# Altium schematic sheet Power and CAN Bus.SchDoc
size B; SheetNumber: 3; SheetTotal: 4
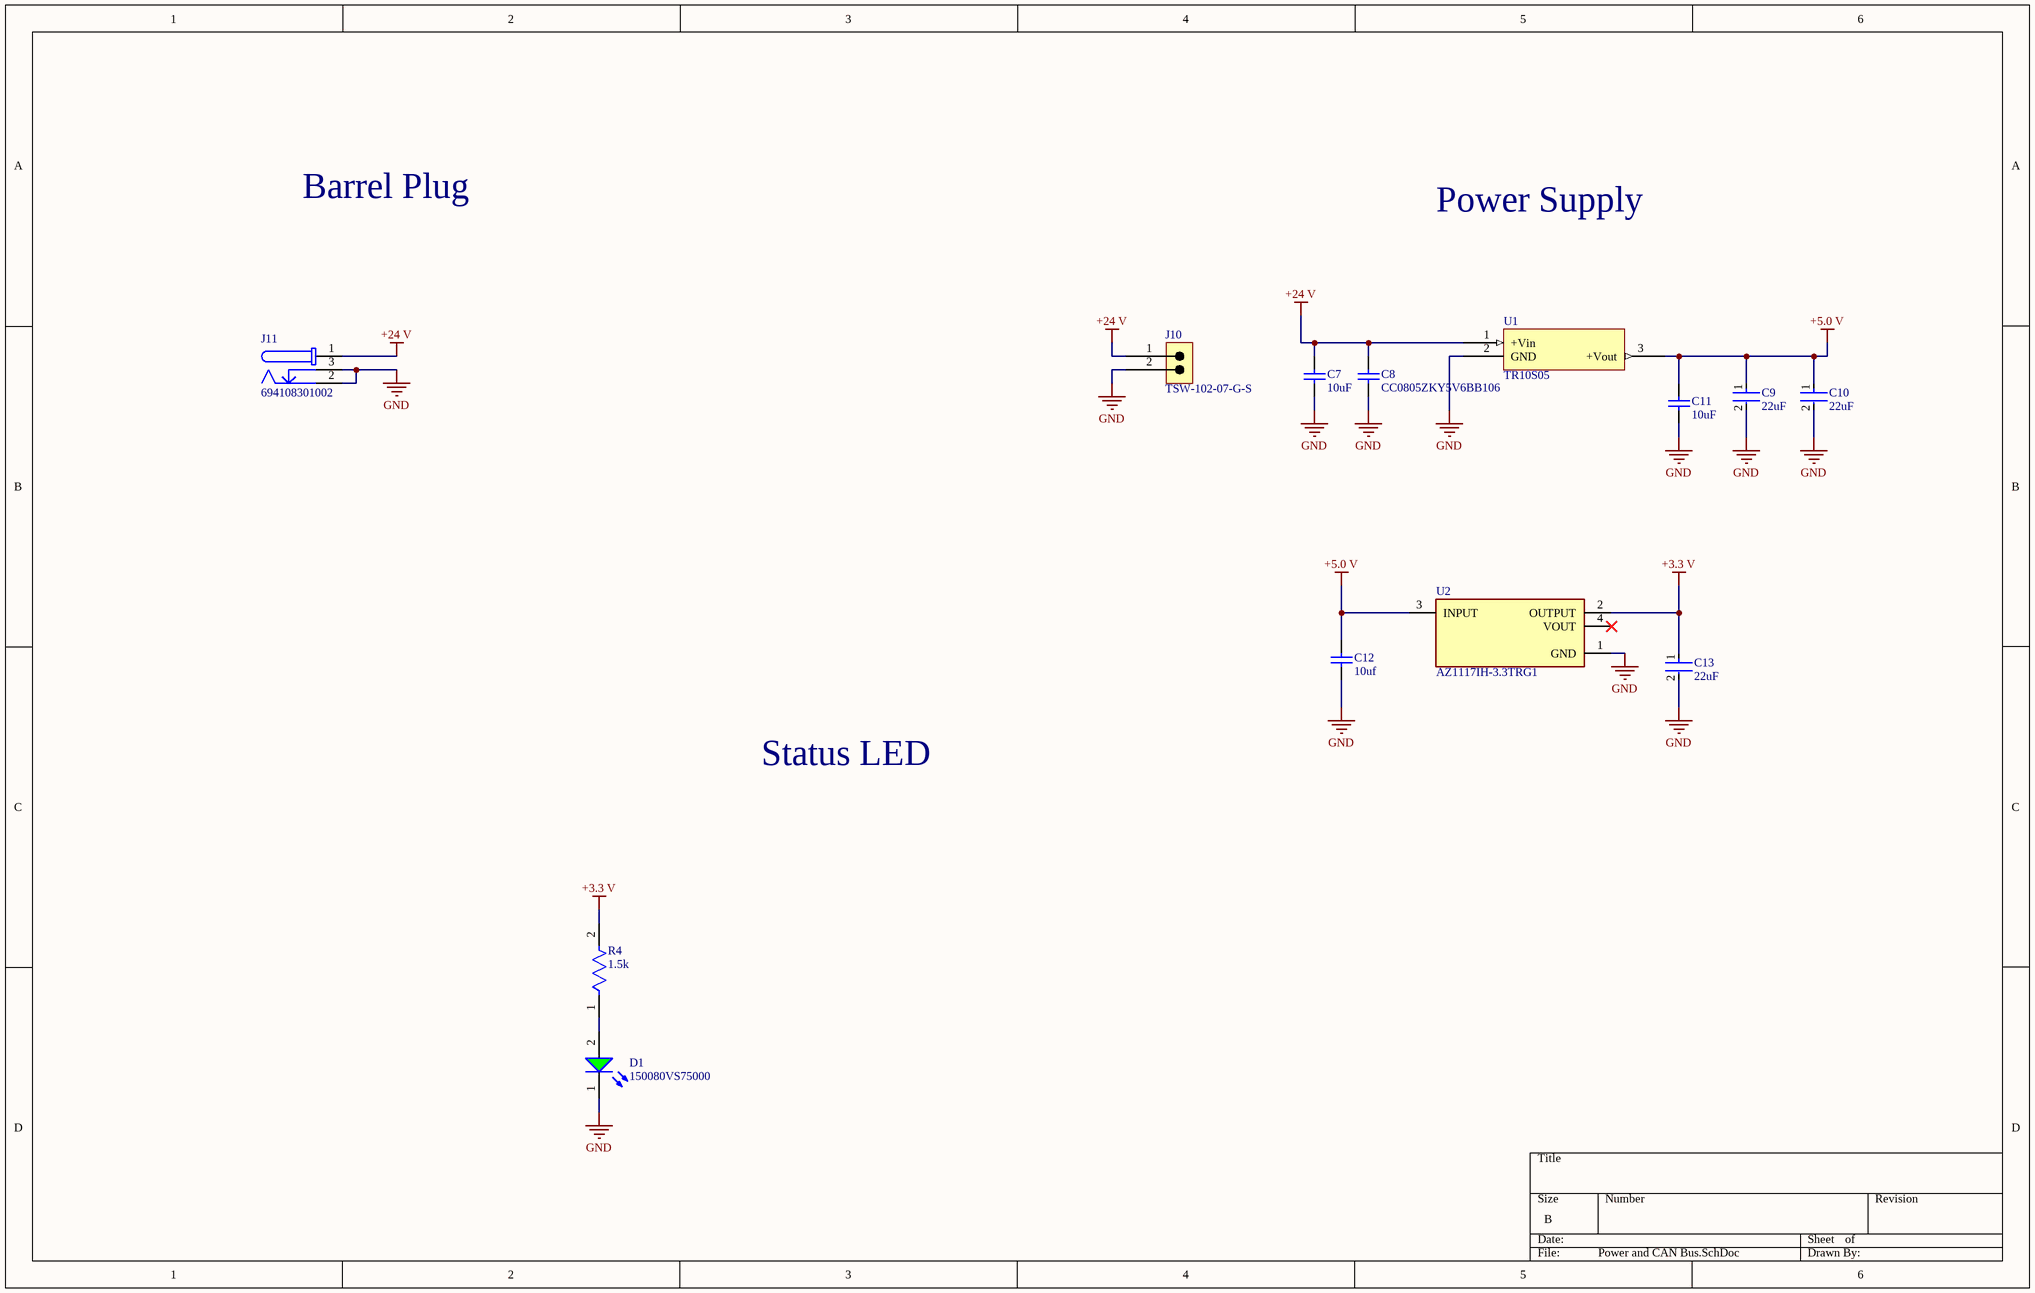
[diagram p0: Power and CAN Bus.SchDoc]

## Parts
C7  10uF  [CC0805ZKY5V6BB106-Footprint-1]
C8  CC0805ZKY5V6BB106  [CC0805ZKY5V6BB106-Footprint-1]
C9  22uF  [FP-GMC21R-IPC_B]
C10  22uF  [FP-GMC21R-IPC_B]
C11  10uF  [CC0805ZKY5V6BB106-Footprint-1]
C12  10uf  [CC0805ZKY5V6BB106-Footprint-1]
C13  22uF  [FP-GMC21R-IPC_B]
D1  150080VS75000  [WL-SMCW_0805_150080xx75000]
J10  TSW-102-07-G-S  [FP-TSW-102-07-G-S-MFG]
J11  694108301002  [694108301002]
R4  1.5k  [FP-RT0805-IPC_A]
U1  TR10S05  [TR10S05-Footprint-1]
U2  AZ1117IH-3.3TRG1  [FP-SOT223-IPC_B]

## Nets
+3.3 V: C13.1 R4.2 U2.2(OUTPUT)
+5.0 V: C9.1 C10.1 C11.2 C12.2 U1.3(+Vout) U2.3(INPUT)
+24 V: C7.2 C8.2 J10.1 J11.1 U1.1(+Vin)
GND: C7.1 C8.1 C9.2 C10.2 C11.1 C12.1 C13.2 D1.1(K) J10.2 J11.2 J11.3 U1.2(GND) U2.1(GND)
NetD1_2: D1.2(A) R4.1

Not connected (* = marked no-connect by the designer): U2 4(VOUT)*

## Notes on the sheet
- Barrel Plug
- Power Supply
- Status LED

## Library data of the parts
C7 C8 C11 C12 = CMP-00010-2: Ceramic Capacitor, Multilayer, Ceramic, 10V, 80% +Tol, 20% -Tol, Y5V, -82/+22% TC, 10uF, Surface Mount, 0805; Multilayer: Yes; Min Operating Temperature: -30°C; Case/Package: 0805; Package Shape: Rectangular; RoHS Compliant: Yes; Termination: Wraparound; Package Style: SMTMeter; Packaging: Tape and Reel; Temperature Characteristics Code: Y5V; Pins: 2; Capacitor Type: Ceramic; Terminal Finish: Nickel; Tolerance (fill in as +-): 80%; Value: 10uF; Max Operating Temperature: 85°C; Length: 2mm; Width: 1.25mm; Dielectric Material: Ceramic; JESD-609 Code: e3; Reach SVHC Compliant: Yes; Height: 1.25mm; Tolerance  (fill in as +-): 20%; Mounting Technology: Surface Mount; Rated DC Voltage (URdc): 10V
C9 C10 C13 = CMP-00027-1: Ceramic Capacitor, Multilayer, Ceramic, 35V, 20% +Tol, 20% -Tol, X5R, 15% TC, 22uF, Surface Mount, 0805
D1 = CMP-00021-1: Single Color LED, Bright Green, Water Clear, 1.4mm; Shape: Rectangular; Luminous Intensity-Nom: 40mcd; Viewing Angle: 140°; Channels: 1; Forward Current: 30mA; Overall Height: 0.7mm; RoHS Compliant: Yes; Max Operating Temperature: 85°C; Optoelectronic Device Type: SINGLE COLOR LED; Color: Green; Min Operating Temperature: -40°C; Terminal Pitch: 2.1mm; Mounting Technology: Surface Mount; Packaging: Tape and Reel; Reach SVHC Compliant: Yes; Size: 1.4mm; Lens Style: WATER CLEAR; Pins: 2
J10 = CMP-00020-2: Board Connector, 2 Contact(s), 1 Row(s), Male, Straight, 0.1 inch Pitch, Solder Terminal, Black Insulator; Additional Feature: E.L.P.; Mixed Contacts: No; Plating Thickness: 10uin; Reliability: COMMERCIAL; Number of Rows Loaded: 1; Option: General Purpose; Number of Contacts: 2; Body/Shell Style: RECEPTACLE; PCB Contact Pattern: RECTANGULAR; Contact Style: SQ PIN-SKT; Mating Information: MULTIPLE MATING PARTS AVAILABLE; Reference Standard: UL; Mating Contact Pitch: 0.1inch; DIN Conformance: No; Terminal Length: 0.1inch; Flammability Rating: UL94 V-0; Body Depth: 0.1inch; Contact Finish - Termination: Gold (Au) - with Nickel (Ni) barrier; Body Breadth: 0.1inch; Reach SVHC Compliant: Yes; MIL Conformance: No; Contact Pattern: RECTANGULAR; Termination: Solder; Insulation Material: Glass; Insulation Color: Black; Terminal Pitch: 2.54mm; Filter Feature: No; Connector Type: BOARD CONNECTOR; Mounting Style: STRAIGHT; Contact Material: Bronze; Number Of Connectors: 1; Number Of PCB Rows: 1; IEC Conformance: No; Contact Finish - Mating: GOLD (10) OVER NICKEL (50); JESD-609 Code: e4; RoHS Compliant: Yes; Contact Gender: Male; Mounting Technology: Board
J11 = CMP-002-00075-2: DC Power Jack Connector WR-DC, Male, Right Angled, THT, 5 A, 24 V; Operating Supply Voltage: 24V; Shielding: Unshielded; Number of Contacts: 3; Pin Diameter: 2.5mm; Current Rating: 5A; Connector Type: Power,Jack; Voltage Rating (DC): 20V; Insulation Resistance: 100MR; Body Color: Black; Max Operating Temperature: 85°C; Gender: Male; Termination: Through Hole; Contact Plating: Tin; Contact Gender: Female; Packaging: Bulk; Series: WR-DC; Package Quantity: 500; Mounting Technology: Through Hole; Min Operating Temperature: -40°C; Housing Material: Polyamide; Flammability Rating: UL94 V-0; Reach SVHC Compliant: Unknown; Voltage Rating: 24V; Height: 11mm; Color: Black; RoHS Compliant: Yes; Contact Material: Copper Alloy
R4 = CMP-00013-1: Fixed Resistor, Thin Film, 0.125W, 1500ohm, 150V, 1% +/-Tol, 50ppm/Cel, Surface Mount, 0805; Package Width: 1.25mm; Package Height: 0.5mm; Additional Feature: HIGH PRECISION; Temperature Coefficient: 50ppm/°C; Power: 125mW; Rated Temperature: 70°C; Package Length: 2mm; Value: 1.5kR; Termination: Wraparound; Packaging: Tape and Reel; Reach SVHC Compliant: Yes; Pins: 2; Working Voltage: 150V; Construction: Chip; Package Style: SMTMeter; Max Operating Temperature: 155°C; Case/Package: 0805; Resistor Type: FIXED RESISTOR; Mounting Technology: Surface Mount; Technology: THIN FILM; Min Operating Temperature: -55°C; Tolerance: 1%; RoHS Compliant: Yes
U1 = CMP-019-00050-2: DC-DC Regulated Power Supply Module; Reach SVHC Compliant: Yes; RoHS Compliant: Yes; Throw Configuration: DC-DC REGULATED POWER SUPPLY MODULE
U2 = CMP-00028-1: Fixed Positive LDO Regulator, 3.3V, 1.3V Dropout, PDSO3; Output Voltage1-Min: 3.235V; Output Current1-Max: 800mA; Output Voltage1-Max: 3.365V; Channels: 1; Max Supply Voltage: 15V; Regulator Type: FIXED POSITIVE SINGLE OUTPUT LDO REGULATOR; Package Body Material: Plastic; Dropout Voltage1-Max: 1.3V; Surface Mount: Yes; Output Voltage1-Nom: 3.3V; Terminal Position: DUAL; Terminal Pitch: 2.3mm; RoHS Compliant: Yes; Case/Package: SOP; Reach SVHC Compliant: Yes; Length: 6.5mm; Operating Temperature, TJ-Max: 125°C; JESD-30 Code: R-PDSO-G3; Operating Temperature, TJ-Min: -40°C; Pins: 3; Height - Seated (Max): 1.8mm; Terminal Form: Gull Wing; Package Style: SMALL OUTLINEMeter; Package Shape: Rectangular; Width: 3.5mm